# Altium schematic sheet OverCurrent_Indicators.SchDoc: Overcurrent Protection
size A4; CheckedBy: G.Kasprowicz; Author: M.Gaska; CompanyName: WUT ISE; DrawnBy: M.Gaska; Organization: WUT ISE; Address1: PW ISE; Address2: Nowowiejska 15/19 00-665 Warsaw; Address3: michalgaska2@gmail.com; DocumentNumber: 8; SheetNumber: 8; SheetTotal: 9; ModifiedBy: M. Fafara; CheckedDate: -; Title2: v2.0; DivGrp: WUT ISE; Designer: M.Gaska; ModifiedDate: -; ProjectName: Sensor Box
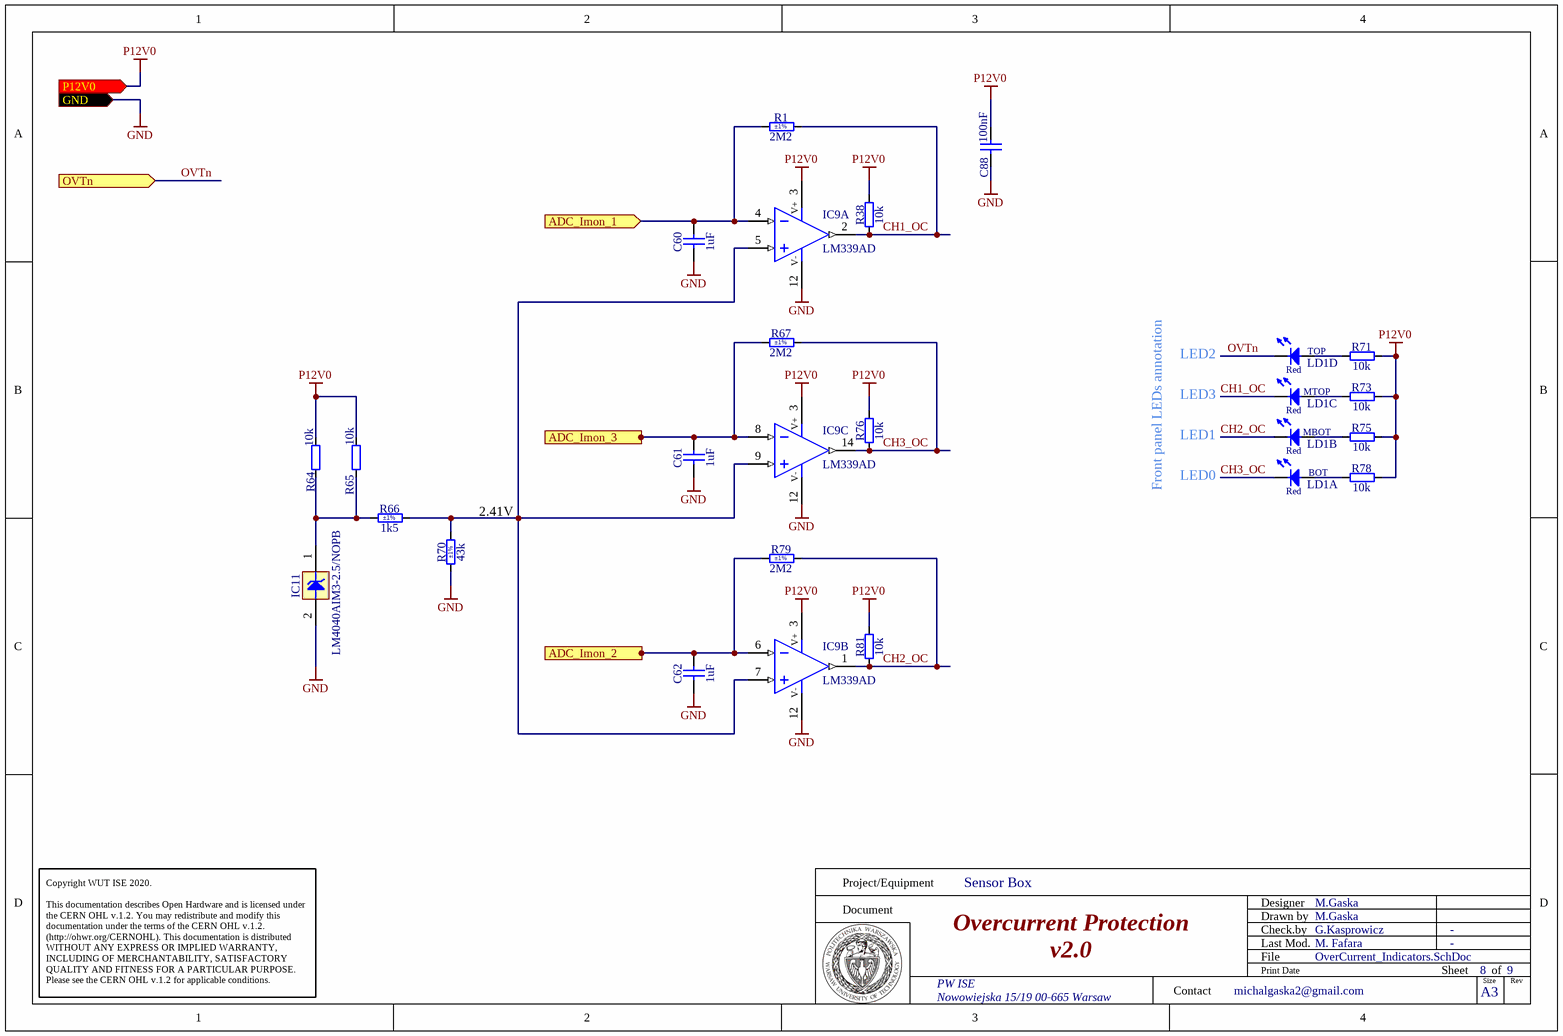
[diagram p0: OverCurrent_Indicators.SchDoc]

## Parts
C60  1uF  [CAPC1608X87N]
C61  1uF  [CAPC1608X87N]
C62  1uF  [CAPC1608X87N]
C88  100nF  [CAPC1608X87N]
IC9  LM339AD  [SOIC127P600X175-14N]  (parts A,B,C of 4)
IC11  LM4040AIM3-2.5/NOPB  [SOT95P251X112-3N]
LD1  (no value)  [LED_BIVAR_H485CHDL]  (parts A,B,C,D of 4)
R1  2M2  Tolerance: ±1%  [RESC1608X55N]
R38  10k  [RESC1608X55N]
R64  10k  [RESC1608X55N]
R65  10k  [RESC1608X55N]
R66  1k5  Tolerance: ±1%  [RESC1608X55N]
R67  2M2  Tolerance: ±1%  [RESC1608X55N]
R70  43k  Tolerance: ±1%  [RESC1608X55N]
R71  10k  [RESC1608X55N]
R73  10k  [RESC1608X55N]
R75  10k  [RESC1608X55N]
R76  10k  [RESC1608X55N]
R78  10k  [RESC1608X55N]
R79  2M2  Tolerance: ±1%  [RESC1608X55N]
R81  10k  [RESC1608X55N]

## Ports
ADC_Imon_1 (in), ADC_Imon_2 (in), ADC_Imon_3 (in), GND (in), OVTn (in), P12V0 (in)

## Nets
GND: C60.1 C61.1 C62.1 C88.1 IC9.12(V-) IC11.2(A) R70.1 ; port GND
P12V0: C88.2 IC9.3(V+) R38.2 R64.2 R65.2 R71.1 R73.1 R75.1 R76.2 R78.1 R81.2 ; port P12V0
ADC_Imon_1: C60.2 IC9.4(IN-) R1.1 ; port ADC_Imon_1
ADC_Imon_2: C62.2 IC9.6(IN-) R79.1 ; port ADC_Imon_2
ADC_Imon_3: C61.2 IC9.8(IN-) R67.1 ; port ADC_Imon_3
CH1_OC: IC9.2(OUT) LD1.5(C) R1.2 R38.1
CH2_OC: IC9.1(OUT) LD1.3(C) R79.2 R81.1
CH3_OC: IC9.14(OUT) LD1.1(C) R67.2 R76.1
OVTn: LD1.7(C) ; port OVTn
NetIC9_5: IC9.5(IN+) IC9.7(IN+) IC9.9(IN+) R66.2 R70.2
NetIC11_1: IC11.1(C) R64.1 R65.1 R66.1
NetLD1_2: LD1.2(A) R78.2
NetLD1_4: LD1.4(A) R75.2
NetLD1_6: LD1.6(A) R73.2
NetLD1_8: LD1.8(A) R71.2

## Notes on the sheet
- LED2
- LED1
- LED3
- (near R70) 2.41V
- Front panel LEDs annotation
- LED0
- Project/Equipment
- Document
- Designer
- Drawn by
- Check.by
- Copyright WUT ISE 2020.
  This documentation describes Open Hardware and is licensed under the CERN OHL v.1.2. You may redistribute and modify this documentation under the terms of the CERN OHL v.1.2. (http://ohwr.org/CERNOHL). This documentation is distributed WITHOUT ANY EXPRESS OR IMPLIED WARRANTY, INCLUDING OF MERCHANTABILITY, SATISFACTORY QUALITY AND FITNESS FOR A PARTICULAR PURPOSE. Please see the CERN OHL v.1.2 for applicable conditions.
- Contact
- File
- Last Mod.
- Print Date
- Sheet
- Size
- A3
- of
- Rev
- (in symbol LED_BIVAR_H485CHDL, part A) BOT; Red
- (in symbol LED_BIVAR_H485CHDL, part B) MBOT; Red
- (in symbol LED_BIVAR_H485CHDL, part C) MTOP; Red
- (in symbol LED_BIVAR_H485CHDL, part D) TOP; Red

## Library data of the parts
C60-C62 = CC0603_1UF_25V_10%_X7R: Non-polarised capacitor; Part Description: SMD Multilayer Chip Ceramic Capacitor; Manufacturer: GENERIC; Manufacturer1 Part Number: GRM188R71E105KA12D; Voltage: 25V; TC: X7R; Tolerance: ±10%; Part Number: CC0603_1UF_25V_10%_X7R; Component Kind: Standard; Component Type: Standard; Pin Count: 2; Value: 1uF; Status: None; Manufacturer Part Number: CC0603_1UF_25V_10%_X7R; Case: 0603; Mounted: Yes; Socket: No; SMD: Yes; Sense: No; Manufacturer1 Example: MURATA; Manufacturer1 ComponentHeight: 0.9mm; HelpURL: \\cern.ch\dfs\Applications\Altium\Datasheets\CC0603_X7R_MURATA.pdf; Author: CERN DEM JLC; CreateDate: 18.01.2011; LatestRevisionDate: 18.01.2011
C88 = CC0603_100NF_50V_10%_X7R: Non-polarised capacitor; Part Description: SMD Multilayer Chip Ceramic Capacitor; Manufacturer: GENERIC; Manufacturer1 Part Number: 223858615649; Voltage: 50V; TC: X7R; Tolerance: ±10%; Part Number: CC0603_100NF_50V_10%_X7R; Component Kind: Standard; Component Type: Standard; Pin Count: 2; Value: 100nF; Status: Preferred; Manufacturer Part Number: CC0603_100NF_50V_10%_X7R; Case: 0603; Mounted: Yes; Socket: No; SMD: Yes; Sense: No; Manufacturer1 Example: PHYCOMP; Manufacturer1 ComponentHeight: 0.87mm; HelpURL: \\cern.ch\dfs\Applications\Altium\Datasheets\CC0603_X7R_PHYCOMP.pdf; Author: CERN DEM JLC; CreateDate: 03.12.2007; LatestRevisionDate: 03.12.2007
IC9 = LM339AD: Quad Operational Amplifier; Part Description: Quad Differential Comparator; Manufacturer: TEXAS INSTRUMENTS; PressFit: No; Bonding: No; Part Number: LM339AD; Component Kind: Standard; Component Type: Standard; Device: LM339AD; PackageDescription: SOIC 14, Pitch 1.27mm - Body 4x8.75mm, IPC Medium Density; Manufacturer Part Number: LM339AD; Pin Count: 14; Case: SOIC14; Mounted: Yes; Socket: No; SMD: Yes; Sense: No; ComponentHeight: 1.75mm; Author: CERN DEM JLC; HelpURL: \\cern.ch\dfs\Applications\Altium\Datasheets\LM339AD.pdf; CreateDate: 09.03.2011; LatestRevisionDate: 09.03.2011
IC11 = LM4040AIM3-2.5/NOPB: Precision Micropower Shunt Voltage Reference; Part Description: 2.5V ±0.1% 100 ppm/°C Precision Micropower Shunt Voltage Reference; Manufacturer: TEXAS INSTRUMENTS; PressFit: No; Bonding: No; Part Number: LM4040AIM3-2.5/NOPB; Component Kind: Standard; Component Type: Standard; Device: LM4040AIM3-2.5/NOPB; PackageDescription: SOT23 3-Leads, Pitch 0.95mm - Body 1.3x2.9mm, IPC Medium Density; Manufacturer Part Number: LM4040AIM3-2.5; Pin Count: 2; Case: SOT23; Mounted: Yes; Socket: No; SMD: Yes; Sense: No; ComponentHeight: 1.12mm; HelpURL: \\cern.ch\dfs\Applications\Altium\Datasheets\LM4040AIM3-2.5-NOPB.pdf; Author: CERN DEM JLC; CreateDate: 30.03.2010; LatestRevisionDate: 01.06.2022
LD1 = LED_BIVAR_H485CHDL: LED x4 Red 1C2A-BOT_3C4A_5C6A_7C8A-TOP; Part Description: Quad-Level 2mm HE Red LED, PCB Edge Mounting; Manufacturer: BIVAR; Color: HE Red; PressFit: No; Bonding: No; Part Number: LED_BIVAR_H485CHDL; Component Kind: Standard; Component Type: Standard; PackageDescription: Quad-Level 2mm HE Red, PCB Edge Mounting  BIVAR H485CHDL; Manufacturer Part Number: H485CHDL; Pin Count: 8; Mounted: Yes; Socket: No; SMD: No; Sense: No; ComponentHeight: 11.3mm; HelpURL: \\cern.ch\dfs\Applications\Altium\Datasheets\LED_BIVAR_H485CHDL.pdf; Author: CERN DEM JLC; CreateDate: 11.12.2008; LatestRevisionDate: 04.06.2012
R1 R67 R79 = R0603_2M2_1%_0.1W_100PPM: Resistor - 1%; Part Description: General Purpose Thick Film Chip Resistor; Manufacturer: GENERIC; Manufacturer1 Part Number: NRC06F2204TRF; Power: 0.1W; TC: ±100ppm/°C; PressFit: No; Part Number: R0603_2M2_1%_0.1W_100PPM; Component Kind: Standard; Component Type: Standard; Pin Count: 2; Value: 2M2; Status: Preferred; Manufacturer Part Number: R0603_2M2_1%_0.1W_100PPM; Case: 0603; Mounted: Yes; Sense: No; Socket: No; SMD: Yes; Manufacturer1 Example: NIC COMPONENT; Manufacturer1 ComponentHeight: 0.55mm; HelpURL: \\cern.ch\dfs\Applications\Altium\Datasheets\R0603_NIC_NRC.pdf; Author: CERN DEM JLC; CreateDate: 03.12.2007; LatestRevisionDate: 13.03.2008
R38 R64 R65 R71 R73 R75 R76 R78 R81 = R0603_10K_1%_0.1W_100PPM: Resistor - 1%; Part Description: General Purpose Thick Film Chip Resistor; Manufacturer: GENERIC; Manufacturer1 Part Number: NRC06F1002TRF; Power: 0.1W; TC: ±100ppm/°C; PressFit: No; Part Number: R0603_10K_1%_0.1W_100PPM; Component Kind: Standard; Component Type: Standard; Pin Count: 2; Value: 10k; Status: Preferred; Tolerance: ±1%; Manufacturer Part Number: R0603_10K_1%_0.1W_100PPM; Case: 0603; Mounted: Yes; Sense: No; Socket: No; SMD: Yes; Manufacturer1 Example: NIC COMPONENT; Manufacturer1 ComponentHeight: 0.55mm; HelpURL: \\cern.ch\dfs\Applications\Altium\Datasheets\R0603_NIC_NRC.pdf; Author: CERN DEM JLC; CreateDate: 03.12.2007; LatestRevisionDate: 13.03.2008
R66 = R0603_1K5_1%_0.1W_100PPM: Resistor - 1%; Part Description: General Purpose Thick Film Chip Resistor; Manufacturer: GENERIC; Manufacturer1 Part Number: NRC06F1501TRF; Power: 0.1W; TC: ±100ppm/°C; PressFit: No; Part Number: R0603_1K5_1%_0.1W_100PPM; Component Kind: Standard; Component Type: Standard; Pin Count: 2; Value: 1k5; Status: Preferred; Manufacturer Part Number: R0603_1K5_1%_0.1W_100PPM; Case: 0603; Mounted: Yes; Sense: No; Socket: No; SMD: Yes; Manufacturer1 Example: NIC COMPONENT; Manufacturer1 ComponentHeight: 0.55mm; HelpURL: \\cern.ch\dfs\Applications\Altium\Datasheets\R0603_NIC_NRC.pdf; Author: CERN DEM JLC; CreateDate: 03.12.2007; LatestRevisionDate: 13.03.2008
R70 = R0603_43K_1%_0.1W_100PPM: Resistor - 1%; Part Description: General Purpose Thick Film Chip Resistor; Manufacturer: GENERIC; Manufacturer1 Part Number: NRC06F4302TRF; Power: 0.1W; TC: ±100ppm/°C; PressFit: No; Part Number: R0603_43K_1%_0.1W_100PPM; Component Kind: Standard; Component Type: Standard; Pin Count: 2; Value: 43k; Status: Preferred; Manufacturer Part Number: R0603_43K_1%_0.1W_100PPM; Case: 0603; Mounted: Yes; Sense: No; Socket: No; SMD: Yes; Manufacturer1 Example: NIC COMPONENT; Manufacturer1 ComponentHeight: 0.55mm; HelpURL: \\cern.ch\dfs\Applications\Altium\Datasheets\R0603_NIC_NRC.pdf; Author: CERN DEM JLC; CreateDate: 03.12.2007; LatestRevisionDate: 13.03.2008